# Altium project source file.PrjPcb
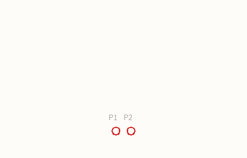
[diagram p0: 4WD Robot Controller.SchDoc, top left]
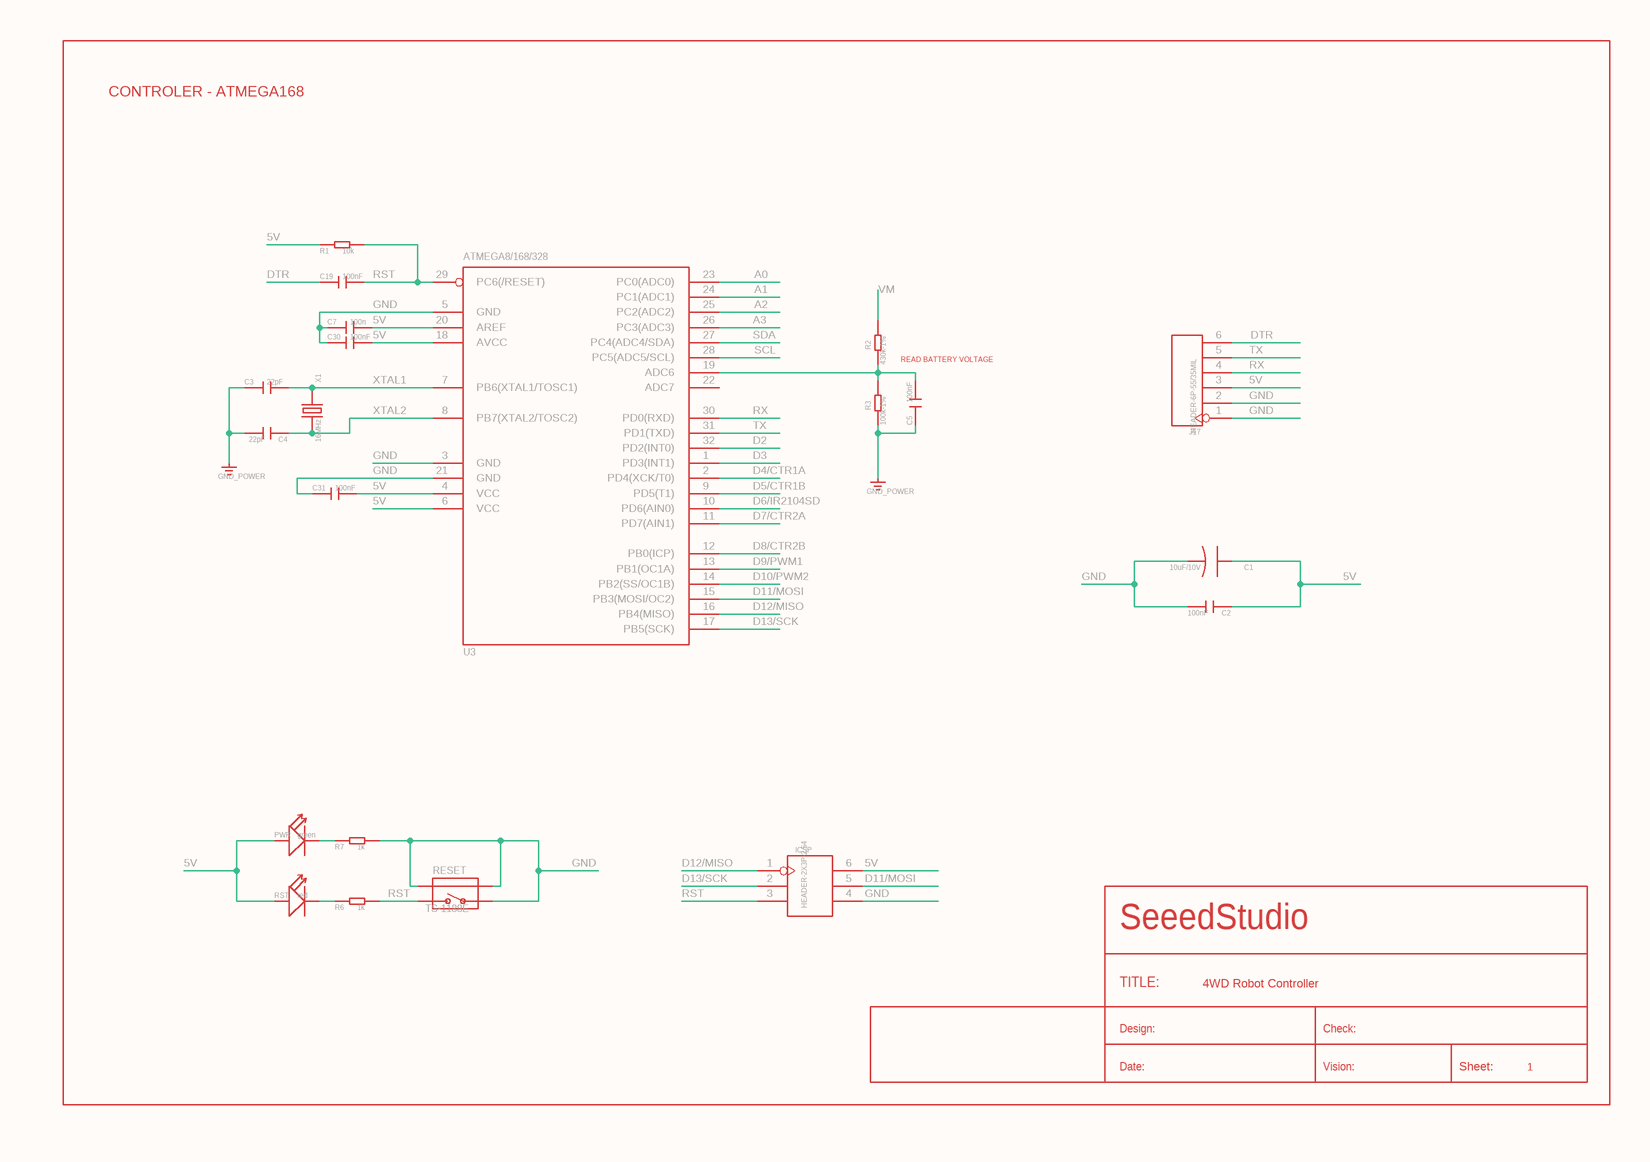
[diagram p1: 4WD Robot Controller.SchDoc, top right]
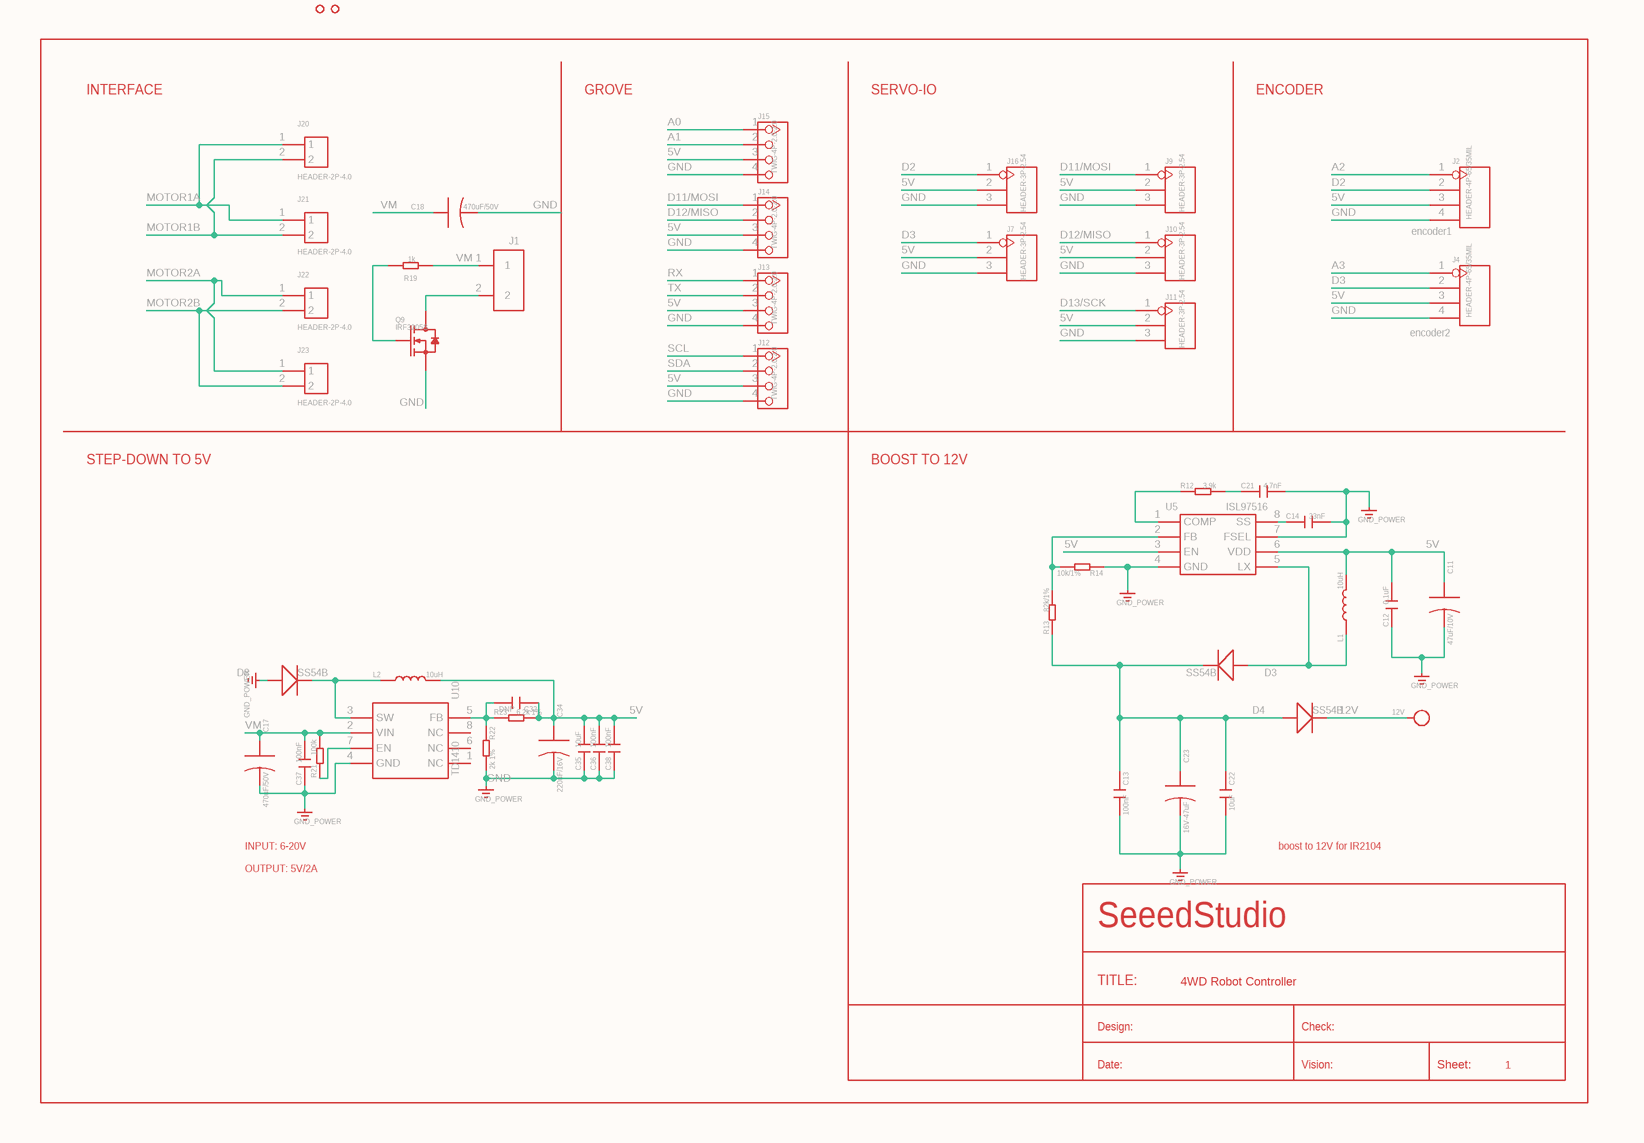
[diagram p2: 4WD Robot Controller.SchDoc, bottom left]
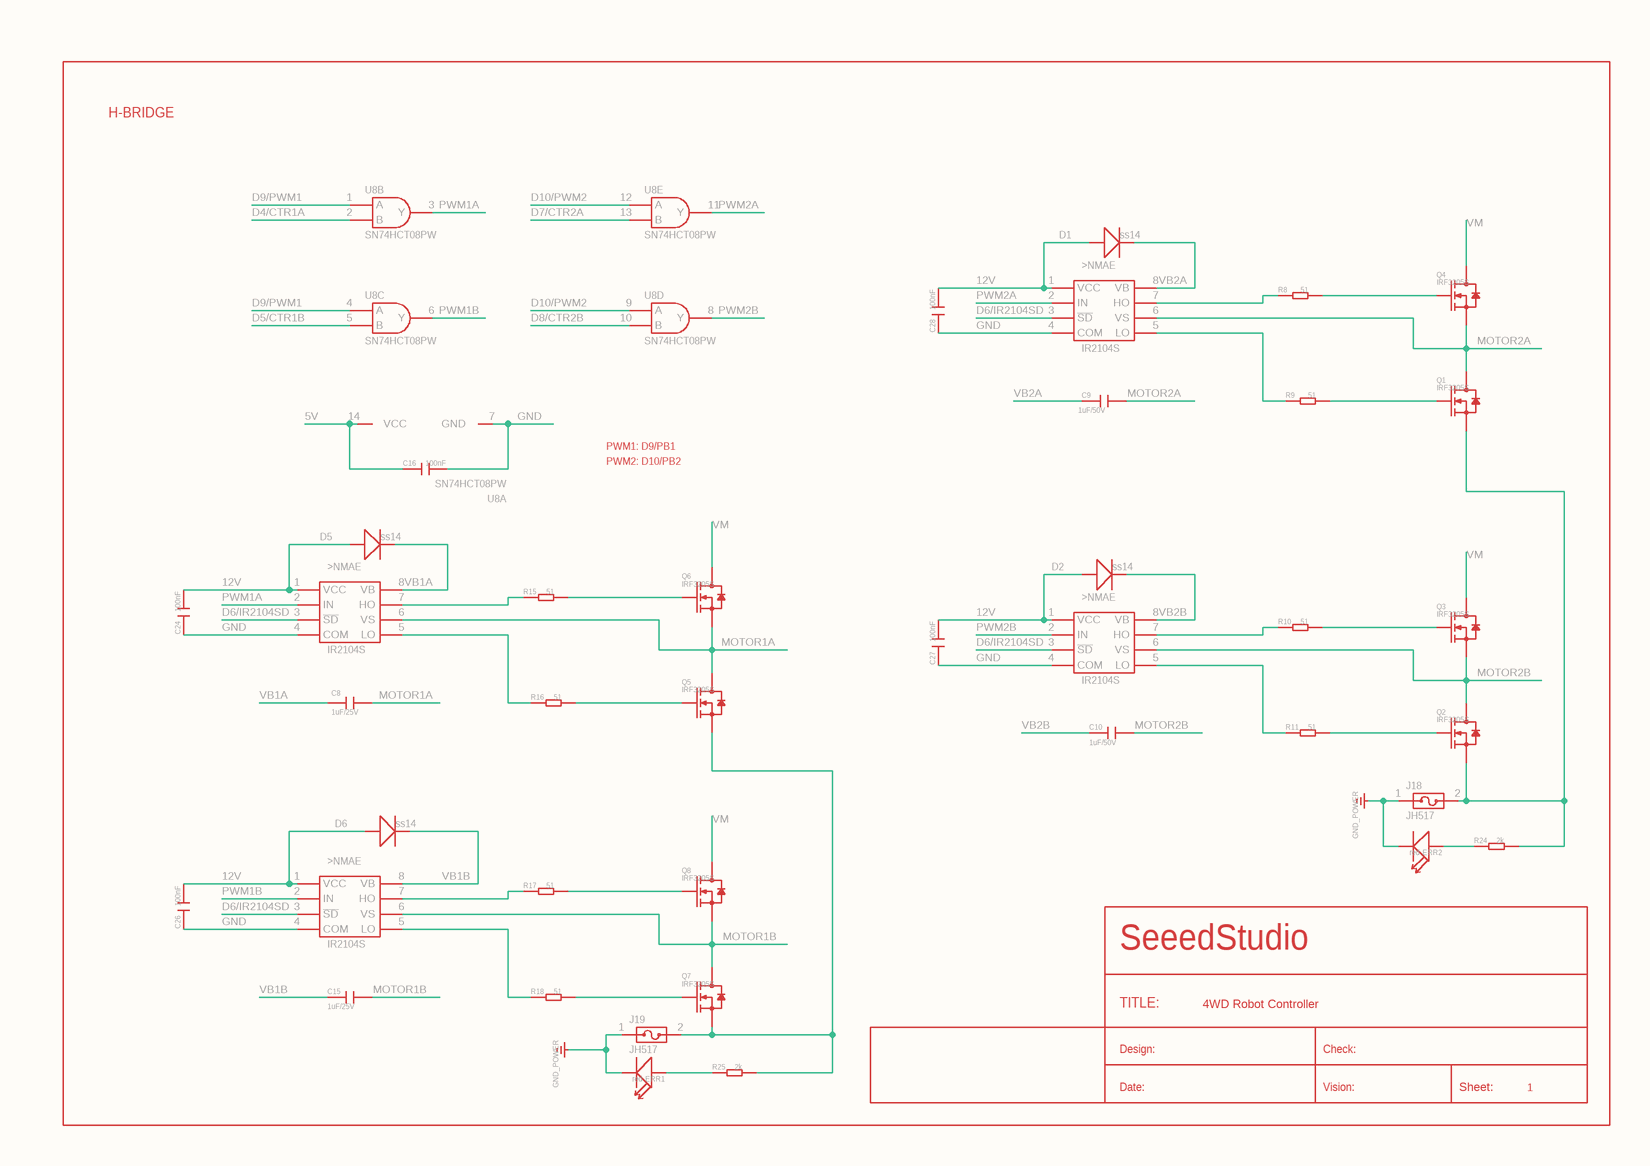
[diagram p3: 4WD Robot Controller.SchDoc, bottom right]
1 sheet, 124 parts. Net scope: global (net labels, ports and power ports of the same name join across sheets).
Board file: 4WD Robot Controller.PcbDoc

## Sheet 4WD Robot Controller.SchDoc
size 556 x 390 mm; Origin: Eagle

### Parts
12V  PAD-TEST-POINT-CIRCLE'4545'  [TP_4545]  (value not drawn)
C1  10uF/10V  [AVX-A]
C2  100nF  [C0603]
C3  22pF  [C0603]
C4  22pF  [C0603]
C5  100nF  [C0603]
C7  100n  [C0603]
C8  1uF/25V  [C0805]
C9  1uF/50V  [C0805]
C10  1uF/50V  [C0805]
C11  47uF/10V  [1210]
C12  0.1uF  [C0603]
C13  100nF  [C0603]
C14  33nF  [C0603]
C15  1uF/25V  [C0805]
C16  100nF  [C0603]
C17  470uF/50V  [ELECTRO-11.36MM]
C18  470uF/50V  [ELECTRO-11.36MM]
C19  100nF  [C0603]
C21  4.7nF  [C0603]
C22  10uF  [C0805]
C23  16V-47uF  [AVX-C]
C24  100nF  [C0603]
C26  100nF  [C0603]
C27  100nF  [C0603]
C28  100nF  [C0603]
C30  100nF  [C0603]
C31  100nF  [C0603]
C32  DNP  [C0603]
C34  220uF/16V  [AVX-D]
C35  10uF  [C0805]
C36  100nF  [C0603]
C37  100nF  [C0603]
C38  100nF  [C0603]
D1  ss14  [D2010]
D2  ss14  [D2010]
D3  SS54B  [SMB]
D4  SS54B  [SMB]
D5  ss14  [D2010]
D6  ss14  [D2010]
D8  SS54B  [SMB]
ERR1  red  [LED-0805]
ERR2  red  [LED-0805]
ICSP  HEADER-2X3P-2.54  [2X3P-2.54]
J1  SCREW-TERMINAL-2P'5.0'  [2P-5.0]  (value not drawn)
J2  HEADER-4P-65/35MIL  [4P-65/35MIL]
J4  HEADER-4P-65/35MIL  [4P-65/35MIL]
J7  HEADER-3P-2.54  [3P-2.54]
J9  HEADER-3P-2.54  [3P-2.54]
J10  HEADER-3P-2.54  [3P-2.54]
J11  HEADER-3P-2.54  [3P-2.54]
J12  TWIG-4P-2.0-2.0  [4P-2.0]
J13  TWIG-4P-2.0-2.0  [4P-2.0]
J14  TWIG-4P-2.0-2.0  [4P-2.0]
J15  TWIG-4P-2.0-2.0  [4P-2.0]
J16  HEADER-3P-2.54  [3P-2.54]
J17  HEADER-6P-55/35MIL  [6P-2.54-55/35MIL]
J18  JH517  [2P-26.9X8.9X15.4H]
J19  JH517  [2P-26.9X8.9X15.4H]
J20  HEADER-2P-4.0  [2P-4.0]
J21  HEADER-2P-4.0  [2P-4.0]
J22  HEADER-2P-4.0  [2P-4.0]
J23  HEADER-2P-4.0  [2P-4.0]
L1  10uH  [2626]
L2  10uH  [L0630]
P1  PAD-MARK  [ROUND-MARK-1.0]  (value not drawn)
P2  PAD-MARK  [ROUND-MARK-1.0]  (value not drawn)
PWR  green  [LED-0603]
Q1  IRF3205S  [TO263AB]
Q2  IRF3205S  [TO263AB]
Q3  IRF3205S  [TO263AB]
Q4  IRF3205S  [TO263AB]
Q5  IRF3205S  [TO263AB]
Q6  IRF3205S  [TO263AB]
Q7  IRF3205S  [TO263AB]
Q8  IRF3205S  [TO263AB]
Q9  IRF3205S  [TO263AB]
R1  10k  [R0603]
R2  430k-1%  [R0603]
R3  100k-1%  [R0603]
R6  1k  [R0603]
R7  1k  [R0603]
R8  51  [R0805]
R9  51  [R0805]
R10  51  [R0805]
R11  51  [R0805]
R12  3.9k  [R0603]
R13  82k/1%  [R0603]
R14  10k/1%  [R0603]
R15  51  [R0805]
R16  51  [R0805]
R17  51  [R0805]
R18  51  [R0805]
R19  1k  [R0603]
R21  100k  [R0603]
R22  2k 1%  [R0603]
R23  6.2k 1%  [R0603]
R24  2k  [R0805]
R25  2k  [R0805]
RESET  TS-1188E  [4P-SMD-7X3.5X3.5H]
RST  red  [LED-0603]
U1  IR2104S  NMAE: >NMAE  [SOIC-8]
U3  ATMEGA8/168/328  [TQFP32]
U4  IR2104S  NMAE: >NMAE  [SOIC-8]
U5  ISL97516  [MSOP8]
U6  IR2104S  NMAE: >NMAE  [SOIC-8]
U7  IR2104S  NMAE: >NMAE  [SOIC-8]
U8  SN74HCT08PW  [TSSOP14]  (parts A,B,C,D,E of 5)
U10  TD1410  [SOP8]
U$1  DRAWING_NAME: 4WD Robot Controller  SHEET: 1  Sheet: Sheet:  TITLE: TITLE:  Design: Design:  Check: Check:  Date: Date:  Vision: Vision:  (hidden comment: SEEEDSTUDIO_SCH_FRAME)
U$2  DRAWING_NAME: 4WD Robot Controller  SHEET: 1  Sheet: Sheet:  TITLE: TITLE:  Design: Design:  Check: Check:  Date: Date:  Vision: Vision:  (hidden comment: SEEEDSTUDIO_SCH_FRAME)
U$4  GND_POWER
U$5  DRAWING_NAME: 4WD Robot Controller  SHEET: 1  Sheet: Sheet:  TITLE: TITLE:  Design: Design:  Check: Check:  Date: Date:  Vision: Vision:  (hidden comment: SEEEDSTUDIO_SCH_FRAME)
U$6  GND_POWER
U$7  GND_POWER
U$8  GND_POWER
U$9  GND_POWER
U$10  GND_POWER
U$11  GND_POWER
U$12  GND_POWER
U$14  GND_POWER
U$18  GND_POWER
U$25  GND_POWER
X1  16MHz  [2P-SMD-5X3.2]

### Nets
5V: C1.+ C2.1 C7.2 C11.+ C12.2 C16.1 C30.2 C31.2 C32.1 C34.+ C35.2 C36.2 C38.2 ICSP.6 J2.3(P$3) J4.3(P$3) J7.2(P$2) J9.2(P$2) J10.2(P$2) J11.2(P$2) J12.3 J13.3 J14.3 J15.3 J16.2(P$2) J17.3 L1.2 L2.2 PWR.+ R1.1 R23.2 RST.+ U3.4(VCC) U3.6(VCC) U3.18(AVCC) U3.20(AREF) U5.3(EN) U5.6(VDD) U8.14(VCC)
12V: 12V.T C24.2 C26.2 C27.2 C28.2 D1.+ D2.+ D4.- D5.+ D6.+ U1.1(VCC) U4.1(VCC) U6.1(VCC) U7.1(VCC)
A0: J15.1 U3.23(PC0(ADC0))
A1: J15.2 U3.24(PC1(ADC1))
A2: J2.1(P$1) U3.25(PC2(ADC2))
A3: J4.1(P$1) U3.26(PC3(ADC3))
D2: J2.2(P$2) J16.1(P$1) U3.32(PD2(INT0))
D3: J4.2(P$2) J7.1(P$1) U3.1(PD3(INT1))
D4/CTR1A: U3.2(PD4(XCK/T0)) U8.2(B)
D5/CTR1B: U3.9(PD5(T1)) U8.5(B)
D6/IR2104SD: U1.3(~{SD}) U3.10(PD6(AIN0)) U4.3(~{SD}) U6.3(~{SD}) U7.3(~{SD})
D7/CTR2A: U3.11(PD7(AIN1)) U8.13(B)
D8/CTR2B: U3.12(PB0(ICP)) U8.10(B)
D9/PWM1: U3.13(PB1(OC1A)) U8.1(A) U8.4(A)
D10/PWM2: U3.14(PB2(SS/OC1B)) U8.9(A) U8.12(A)
D11/MOSI: ICSP.5 J9.1(P$1) J14.1 U3.15(PB3(MOSI/OC2))
D12/MISO: ICSP.1 J10.1(P$1) J14.2 U3.16(PB4(MISO))
D13/SCK: ICSP.2 J11.1(P$1) U3.17(PB5(SCK))
DTR: C19.1 J17.6
GND: C1.- C2.2 C7.1 C16.2 C18.- C24.1 C26.1 C27.1 C28.1 C30.1 C31.1 C34.- C35.1 C36.1 C38.1 ICSP.4 J2.4(P$4) J4.4(P$4) J7.3(P$3) J9.3(P$3) J10.3(P$3) J11.3(P$3) J12.4 J13.4 J14.4 J15.4 J16.3(P$3) J17.1 J17.2 Q9.3(S) R7.2 R22.2 RESET.1 RESET.S1 RESET.S2 U1.4(COM) U3.3(GND) U3.5(GND) U3.21(GND) U4.4(COM) U6.4(COM) U7.4(COM) U8.7(GND) U$12.?1(GND)
MOTOR1A: C8.2 C15.2 J20.1 J20.2 J21.1 J21.2 Q5.2(D) Q6.3(S) Q7.2(D) Q8.3(S) U6.6(VS) U7.6(VS)  [also labelled MOTOR1B]
MOTOR2A: C9.2 C10.2 J22.1 J22.2 J23.1 J23.2 Q1.2(D) Q2.2(D) Q3.3(S) Q4.3(S) U1.6(VS) U4.6(VS)  [also labelled MOTOR2B]
PWM1A: U6.2(IN) U8.3(Y)
PWM1B: U7.2(IN) U8.6(Y)
PWM2A: U1.2(IN) U8.11(Y)
PWM2B: U4.2(IN) U8.8(Y)
RST: C19.2 ICSP.3 R1.2 R6.2 RESET.2 U3.29(PC6(/RESET))
RX: J13.1 J17.4 U3.30(PD0(RXD))
SCL: J12.1 U3.28(PC5(ADC5/SCL))
SDA: J12.2 U3.27(PC4(ADC4/SDA))
TX: J13.2 J17.5 U3.31(PD1(TXD))
VB1A: C8.1 D5.- U6.8(VB)
VB1B: C15.1 D6.- U7.8(VB)
VB2A: C9.1 D1.- U1.8(VB)
VB2B: C10.1 D2.- U4.8(VB)
VM: C17.+ C18.+ C37.2 J1.1 Q3.2(D) Q4.2(D) Q6.2(D) Q8.2(D) R2.2 R19.1 R21.2 U10.2(VIN)
XTAL1: C3.2 U3.7(PB6(XTAL1/TOSC1)) X1.1
XTAL2: C4.1 U3.8(PB7(XTAL2/TOSC2)) X1.2
NetC3_1: C3.1 C4.2 U$4.?1(GND)
NetC5_1: C5.1 R3.1 U$14.?1(GND)
NetC5_2: C5.2 R2.1 R3.2 U3.19(ADC6)
NetC11_-: C11.- C12.1 U$7.?1(GND)
NetC13_1: C13.1 C22.1 C23.+ D3.- D4.+ R13.1
NetC13_2: C13.2 C22.2 C23.- U$8.?1(GND)
NetC14_1: C14.1 U5.8(SS)
NetC14_2: C14.2 C21.2 U5.7(FSEL) U$9.?1(GND)
NetC17_-: C17.- C37.1 U10.4(GND) U$18.?1(GND)
NetC21_1: C21.1 R12.2
NetC32_2: C32.2 R22.1 R23.1 U10.5(FB)
NetD3_+: D3.+ L1.1 U5.5(LX)
NetD8_+: D8.+ U$25.?1(GND)
NetD8_-: D8.- L2.1 U10.3(SW)
NetERR1_+: ERR1.+ R25.1
NetERR1_-: ERR1.- J19.1 U$10.?1(GND)
NetERR2_+: ERR2.+ R24.1
NetERR2_-: ERR2.- J18.1 U$11.?1(GND)
NetJ1_2: J1.2 Q9.2(D)
NetJ18_2: J18.2 Q1.3(S) Q2.3(S) R24.2
NetJ19_2: J19.2 Q5.3(S) Q7.3(S) R25.2
NetPWR_-: PWR.- R7.1
NetQ1_1: Q1.1(G) R9.2
NetQ2_1: Q2.1(G) R11.2
NetQ3_1: Q3.1(G) R10.2
NetQ4_1: Q4.1(G) R8.2
NetQ5_1: Q5.1(G) R16.2
NetQ6_1: Q6.1(G) R15.2
NetQ7_1: Q7.1(G) R18.2
NetQ8_1: Q8.1(G) R17.2
NetQ9_1: Q9.1(G) R19.2
NetR6_1: R6.1 RST.-
NetR8_1: R8.1 U1.7(HO)
NetR9_1: R9.1 U1.5(LO)
NetR10_1: R10.1 U4.7(HO)
NetR11_1: R11.1 U4.5(LO)
NetR12_1: R12.1 U5.1(COMP)
NetR13_2: R13.2 R14.2 U5.2(FB)
NetR14_1: R14.1 U5.4(GND) U$6.?1(GND)
NetR15_1: R15.1 U6.7(HO)
NetR16_1: R16.1 U6.5(LO)
NetR17_1: R17.1 U7.7(HO)
NetR18_1: R18.1 U7.5(LO)
NetR21_1: R21.1 U10.7(EN)

Not connected (* = marked no-connect by the designer): U3 22(ADC7); U10 1(NC) 6(NC) 8(NC)

### Notes on the sheet
- CONTROLER - ATMEGA168
- READ BATTERY VOLTAGE
- INTERFACE
- GROVE
- SERVO-IO
- ENCODER
- H-BRIDGE
- (near J2) encoder1
- (near J4) encoder2
- PWM1: D9/PB1
- STEP-DOWN TO 5V
- BOOST TO 12V
- PWM2: D10/PB2
- (near U$18) INPUT: 6-20V
- (near U$18) OUTPUT: 5V/2A
- boost to 12V for IR2104

### Library data of the parts
12V = PAD-TEST-POINT-CIRCLE'4545': PARTNO: DNP; GateName_1: TP; SymbolName_1: TEST_POINT; DeviceName: '4545'; LibraryName: Discrete; DeviceSetName: PAD-TEST-POINT-CIRCLE
C1 = CAP*-AVX-A: Electrolytic Capacitors,Tantalum Capacitors and Super Capacitors; GateName_1: C; DeviceName: -AVX-A; DeviceSetName: CAP*; SymbolName_1: CAPACITOR; LibraryName: Discrete; +: +; -: -
C2-C5 C7 C12-C14 C16 C19 C21 C24 C26-C28 C30-C32 C36-C38 = C*-0603: Ceramic Capacitors; GateName_1: C; DeviceName: -0603; DeviceSetName: C*; SymbolName_1: C; LibraryName: Discrete
C8-C10 C15 C22 C35 = C*-0805: Ceramic Capacitors; GateName_1: C; DeviceName: -0805; DeviceSetName: C*; SymbolName_1: C; LibraryName: Discrete
C11 = CAP*-1210: Electrolytic Capacitors,Tantalum Capacitors and Super Capacitors; GateName_1: C; DeviceName: -1210; DeviceSetName: CAP*; SymbolName_1: CAPACITOR; LibraryName: Discrete; +: +; -: -
C17 C18 = CAP*-D11.36/5.08: Electrolytic Capacitors,Tantalum Capacitors and Super Capacitors; GateName_1: C; DeviceSetName: CAP*; SymbolName_1: CAPACITOR; DeviceName: -D11.36/5.08; LibraryName: Discrete; +: +; -: -
C23 = CAP*-AVX-C: Electrolytic Capacitors,Tantalum Capacitors and Super Capacitors; GateName_1: C; DeviceName: -AVX-C; DeviceSetName: CAP*; SymbolName_1: CAPACITOR; LibraryName: Discrete; +: +; -: -
C34 = CAP*-AVX-D: Electrolytic Capacitors,Tantalum Capacitors and Super Capacitors; GateName_1: C; DeviceName: -AVX-D; DeviceSetName: CAP*; SymbolName_1: CAPACITOR; LibraryName: Discrete; +: +; -: -
D1 D2 D5 D6 = D*'SMA': GateName_1: D; SymbolName_1: DIODE; DeviceName: 'SMA'; DeviceSetName: D*; LibraryName: Discrete
D3 D4 D8 = D*'MBRS240LT3': GateName_1: D; SymbolName_1: DIODE; DeviceSetName: D*; DeviceName: 'MBRS240LT3'; LibraryName: Discrete
ERR1 ERR2 = LED*'0805': GateName_1: LED; DeviceName: '0805'; DeviceSetName: LED*; SymbolName_1: LED; LibraryName: Discrete
ICSP = HEADER-2X3P-2.54: GateName_1: J; SymbolName_1: CK_2X3; DeviceName: -2.54; LibraryName: Connector; DeviceSetName: HEADER-2X3P
J1 = SCREW-TERMINAL-2P'5.0': GateName_1: G$1; DeviceName: '5.0'; SymbolName_1: SCREW-TERMINAL-2P; LibraryName: Connector; DeviceSetName: SCREW-TERMINAL-2P
J2 J4 = HEADER-4P-65/35MIL: GateName_1: G$1; SymbolName_1: CK_1X4; DeviceName: -65/35MIL; LibraryName: Connector; DeviceSetName: HEADER-4P
J7 J9-J11 J16 = HEADER-3P-2.54: GateName_1: G$1; SymbolName_1: TER_3.5X3; DeviceName: -2.54; LibraryName: Connector; DeviceSetName: HEADER-3P
J12-J15 = TWIG-4P-2.0-2.0: GateName_1: G$1; SymbolName_1: TWIG_2.0; DeviceName: -2.0; LibraryName: Connector; DeviceSetName: TWIG-4P-2.0
J17 = HEADER-6P-55/35MIL: GateName_1: J; SymbolName_1: CK_1X6; DeviceName: -55/35MIL; LibraryName: Connector; DeviceSetName: HEADER-6P
J18 J19 = HOLDER-FUSE'ＪＨ５１７': JH-510 FUSE HOLDER; GateName_1: G$1; SymbolName_1: HOLDER-FUSE; DeviceName: 'ＪＨ５１７'; LibraryName: template; DeviceSetName: HOLDER-FUSE
J20-J23 = HEADER-2P-4.0: GateName_1: G$1; SymbolName_1: HEADER-2P-4.0; LibraryName: template; DeviceSetName: HEADER-2P-4.0
L1 = L*'IHLP-2525BD-01': GateName_1: L; DeviceSetName: L*; SymbolName_1: L; DeviceName: 'IHLP-2525BD-01'; LibraryName: Discrete
L2 = L*'0630': GateName_1: L; DeviceName: '0630'; DeviceSetName: L*; SymbolName_1: L; LibraryName: Discrete
P1 P2 = PAD-MARK: PARTNO: DNP; GateName_1: G$1; SymbolName_1: MARK; LibraryName: Discrete; DeviceSetName: PAD-MARK
PWR RST = LED*'0603': GateName_1: LED; DeviceName: '0603'; DeviceSetName: LED*; SymbolName_1: LED; LibraryName: Discrete
Q1-Q9 = MOSFET-N*'IRF3205ZSPBF': IRLL014: http://www.vishay.com/docs/91319/sihll014.pdf; GateName_1: MOS; SymbolName_1: N-MOS; DeviceName: 'IRF3205ZSPBF'; LibraryName: template; DeviceSetName: MOSFET-N*; D: D; S: S; G: G
R1-R3 R6 R7 R12-R14 R19 R21-R23 = R*-0603: GateName_1: R; DeviceName: -0603; DeviceSetName: R*; SymbolName_1: R; LibraryName: Discrete
R8-R11 R15-R18 R24 R25 = R*-0805: GateName_1: R; DeviceName: -0805; DeviceSetName: R*; SymbolName_1: R; LibraryName: Discrete
RESET = BUTTON-4P-REINFORCE'TS-1188E': TS-1188E  http://www.best-dz.com/?thread-374-2.html; GateName_1: SW; SymbolName_1: BUTTON-4P-SMD; DeviceName: 'TS-1188E'; LibraryName: Discrete; DeviceSetName: BUTTON-4P-REINFORCE
U1 U4 U6 U7 = IR2104S: HALF-BRIDGE DRIVER; GateName_1: G$1; SymbolName_1: IR2104S; LibraryName: IC-dwin; DeviceSetName: IR2104S
U3 = ATMEGA8/168/328: MICROCONTROLLER; GateName_1: G$1; SymbolName_1: ATMEGA168; LibraryName: IC; DeviceSetName: ATMEGA8/168/328
U5 = ISL97516-MSOP8: 600kHz/1.2MHz PWM Step-Up Regulator   http://www.intersil.com/data/fn/fn9261.pdf; GateName_1: G$1; DeviceName: -MSOP8; SymbolName_1: ISL97516; LibraryName: IC; DeviceSetName: ISL97516
U8 = SN74HCT08PW: Quadruple 2-Input Positive-AND Gates; GateName_1: PWR; SymbolName_1: POWER-GND; GateName_2: A; SymbolName_2: AND-GATE; GateName_3: B; GateName_4: C; GateName_5: D; DeviceName: PW; SymbolName_3: AND-GATE; SymbolName_4: AND-GATE; SymbolName_5: AND-GATE; LibraryName: template; DeviceSetName: SN74HCT08
U10 = TD1410: 2A 380KHz 20V PWM Buck DC/DC Converter; GateName_1: G$1; SymbolName_1: TD1410; LibraryName: template; DeviceSetName: TD1410
U$1 U$2 U$5 = SEEEDSTUDIO_SCH_FRAME: GateName_1: G$1; SymbolName_1: SEEEDSTUDIO_SCH_FRAME; LibraryName: template; DeviceSetName: SEEEDSTUDIO_SCH_FRAME; SeeedStudio: SeeedStudio
U$4 U$6-U$12 U$14 U$18 U$25 = GND_POWER: GateName_1: G$1; SymbolName_1: GND_POWER; LibraryName: Power or GND; DeviceSetName: GND_POWER
X1 = CRYSTAL*'5032': CRYSTAL; GateName_1: X; SymbolName_1: Q; DeviceName: '5032'; LibraryName: Discrete; DeviceSetName: CRYSTAL*; 1: 1; 2: 2